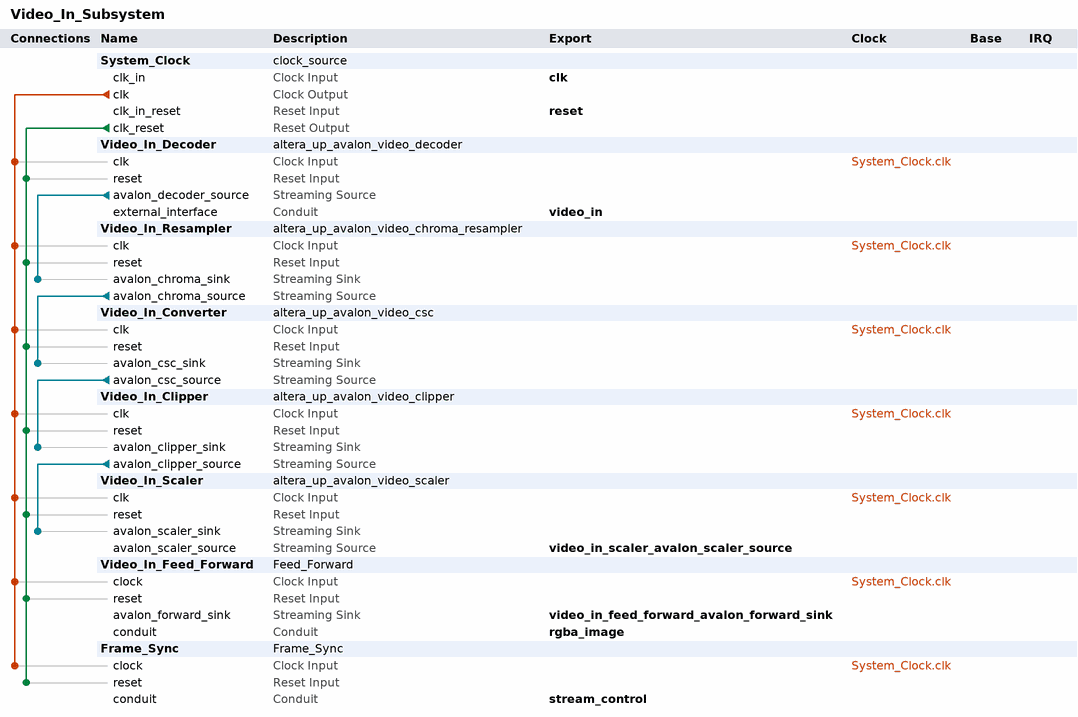
[diagram p0: system contents]
# Platform Designer (Qsys) system Video_In_Subsystem, Cyclone V 5CSEMA5F31C6
# Parameters at their usual value, and those the tool derives, are not listed.
package require -exact qsys 17.1
create_system Video_In_Subsystem
set_project_property DEVICE_FAMILY {Cyclone V}
set_project_property DEVICE 5CSEMA5F31C6

add_instance System_Clock clock_source 17.1
set_instance_parameter_value System_Clock clockFrequency 50000000

add_instance Video_In_Decoder altera_up_avalon_video_decoder 17.1

add_instance Video_In_Resampler altera_up_avalon_video_chroma_resampler 17.1

add_instance Video_In_Converter altera_up_avalon_video_csc 17.1

add_instance Video_In_Clipper altera_up_avalon_video_clipper 17.1
set_instance_parameter_value Video_In_Clipper color_bits 8
set_instance_parameter_value Video_In_Clipper color_planes 3

add_instance Video_In_Scaler altera_up_avalon_video_scaler 17.1
set_instance_parameter_value Video_In_Scaler color_bits 8
set_instance_parameter_value Video_In_Scaler color_planes 3
set_instance_parameter_value Video_In_Scaler height_scaling 2
set_instance_parameter_value Video_In_Scaler width_in 640
set_instance_parameter_value Video_In_Scaler width_scaling 1

add_instance Video_In_Feed_Forward Feed_Forward 1.0
set_instance_parameter_value Video_In_Feed_Forward EW 1
set_instance_parameter_value Video_In_Feed_Forward IDW 23
set_instance_parameter_value Video_In_Feed_Forward ODW 31

add_instance Frame_Sync Frame_Sync 1.0

# connections
add_connection System_Clock.clk Frame_Sync.clock clock
add_connection System_Clock.clk Video_In_Clipper.clk clock
add_connection System_Clock.clk Video_In_Converter.clk clock
add_connection System_Clock.clk Video_In_Decoder.clk clock
add_connection System_Clock.clk Video_In_Feed_Forward.clock clock
add_connection System_Clock.clk Video_In_Resampler.clk clock
add_connection System_Clock.clk Video_In_Scaler.clk clock
add_connection System_Clock.clk_reset Frame_Sync.reset reset
add_connection System_Clock.clk_reset Video_In_Clipper.reset reset
add_connection System_Clock.clk_reset Video_In_Converter.reset reset
add_connection System_Clock.clk_reset Video_In_Decoder.reset reset
add_connection System_Clock.clk_reset Video_In_Feed_Forward.reset reset
add_connection System_Clock.clk_reset Video_In_Resampler.reset reset
add_connection System_Clock.clk_reset Video_In_Scaler.reset reset
add_connection Video_In_Clipper.avalon_clipper_source Video_In_Scaler.avalon_scaler_sink avalon_streaming
add_connection Video_In_Converter.avalon_csc_source Video_In_Clipper.avalon_clipper_sink avalon_streaming
add_connection Video_In_Decoder.avalon_decoder_source Video_In_Resampler.avalon_chroma_sink avalon_streaming
add_connection Video_In_Resampler.avalon_chroma_source Video_In_Converter.avalon_csc_sink avalon_streaming

# exported interfaces
add_interface clk clock sink
set_interface_property clk EXPORT_OF System_Clock.clk_in
add_interface reset reset sink
set_interface_property reset EXPORT_OF System_Clock.clk_in_reset
add_interface rgba_image conduit end
set_interface_property rgba_image EXPORT_OF Video_In_Feed_Forward.conduit
add_interface stream_control conduit end
set_interface_property stream_control EXPORT_OF Frame_Sync.conduit
add_interface video_in conduit end
set_interface_property video_in EXPORT_OF Video_In_Decoder.external_interface
add_interface video_in_feed_forward_avalon_forward_sink avalon_streaming sink
set_interface_property video_in_feed_forward_avalon_forward_sink EXPORT_OF Video_In_Feed_Forward.avalon_forward_sink
add_interface video_in_scaler_avalon_scaler_source avalon_streaming source
set_interface_property video_in_scaler_avalon_scaler_source EXPORT_OF Video_In_Scaler.avalon_scaler_source

set_interconnect_requirement {$system} qsys_mm.clockCrossingAdapter HANDSHAKE
set_interconnect_requirement {$system} qsys_mm.enableEccProtection FALSE
set_interconnect_requirement {$system} qsys_mm.insertDefaultSlave FALSE
set_interconnect_requirement {$system} qsys_mm.maxAdditionalLatency 1

save_system Video_In_Subsystem.qsys
